# Altium schematic sheet BMS-BQ76930.SchDoc
size A2; SheetNumber: 1; SheetTotal: 3
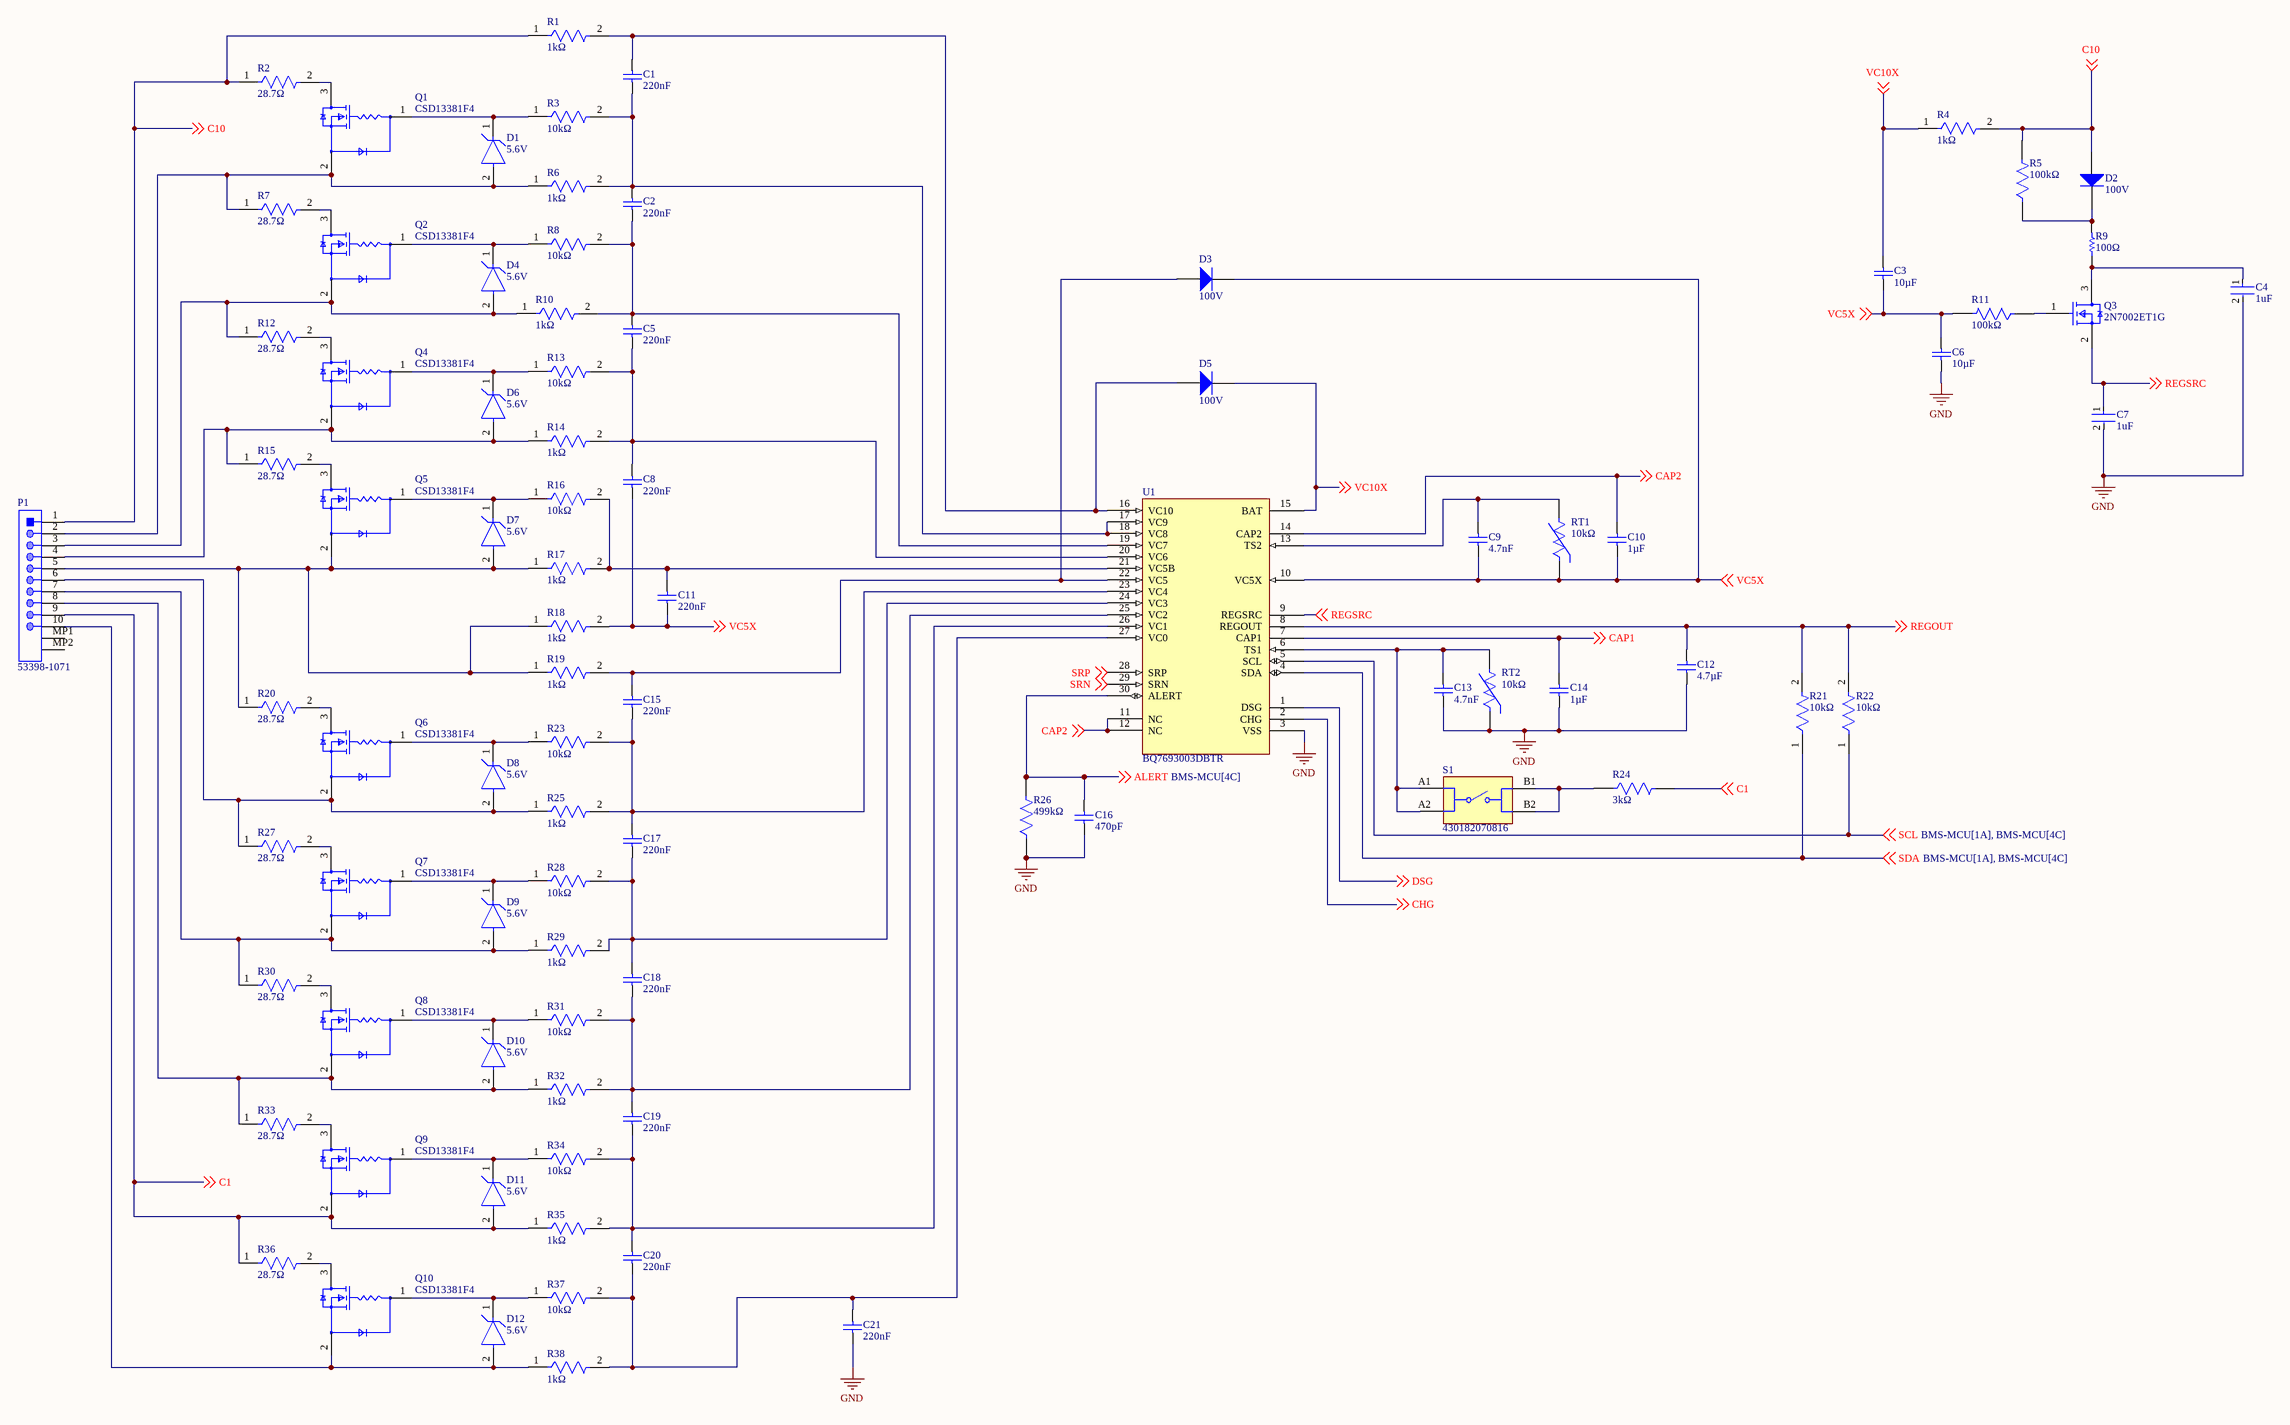
[diagram p0: BMS-BQ76930.SchDoc]

## Parts
C1  Capacitance: 220nF  [WCAP-CSGP_0603_L1.6W0.8H0.8_Reflow]  (hidden comment: 885012206048)
C2  Capacitance: 220nF  [WCAP-CSGP_0603_L1.6W0.8H0.8_Reflow]  (hidden comment: 885012206048)
C3  Capacitance: 10µF  [CAPC3225X270X30ML30]  (hidden comment: GRM32ER7YA106KA12L)
C4  Capacitance: 1uF  [FP-GCJ21B-0_3-IPC_B]  (hidden comment: GCJ21BR71H105KA01L)
C5  Capacitance: 220nF  [WCAP-CSGP_0603_L1.6W0.8H0.8_Reflow]  (hidden comment: 885012206048)
C6  Capacitance: 10µF  [CAPC3225X270X30ML30]  (hidden comment: GRM32ER7YA106KA12L)
C7  Capacitance: 1uF  [FP-GCJ21B-0_3-IPC_B]  (hidden comment: GCJ21BR71H105KA01L)
C8  Capacitance: 220nF  [WCAP-CSGP_0603_L1.6W0.8H0.8_Reflow]  (hidden comment: 885012206048)
C9  Capacitance: 4.7nF  [WCAP-CSGP_0603_L1.6W0.8H0.8_Reflow]  (hidden comment: 885012206087)
C10  Capacitance: 1µF  [WCAP-CSGP_0603_L1.6W0.8H0.8_Reflow]  (hidden comment: 885012206052)
C11  Capacitance: 220nF  [WCAP-CSGP_0603_L1.6W0.8H0.8_Reflow]  (hidden comment: 885012206048)
C12  Capacitance: 4.7µF  [WCAP-CSGP_0805_L2W1.25H1.25]  (hidden comment: 885012207025)
C13  Capacitance: 4.7nF  [WCAP-CSGP_0603_L1.6W0.8H0.8_Reflow]  (hidden comment: 885012206087)
C14  Capacitance: 1µF  [WCAP-CSGP_0603_L1.6W0.8H0.8_Reflow]  (hidden comment: 885012206052)
C15  Capacitance: 220nF  [WCAP-CSGP_0603_L1.6W0.8H0.8_Reflow]  (hidden comment: 885012206048)
C16  Capacitance: 470pF  [WCAP-CSGP_0603_L1.6W0.8H0.8_Reflow]  (hidden comment: 885012206081)
C17  Capacitance: 220nF  [WCAP-CSGP_0603_L1.6W0.8H0.8_Reflow]  (hidden comment: 885012206048)
C18  Capacitance: 220nF  [WCAP-CSGP_0603_L1.6W0.8H0.8_Reflow]  (hidden comment: 885012206048)
C19  Capacitance: 220nF  [WCAP-CSGP_0603_L1.6W0.8H0.8_Reflow]  (hidden comment: 885012206048)
C20  Capacitance: 220nF  [WCAP-CSGP_0603_L1.6W0.8H0.8_Reflow]  (hidden comment: 885012206048)
C21  Capacitance: 220nF  [WCAP-CSGP_0603_L1.6W0.8H0.8_Reflow]  (hidden comment: 885012206048)
D1  Voltage Rating (DC): 5.6V  [FP-477-02-MFG]  (hidden comment: MM3Z5V6ST1G)
D2  Peak Reverse Voltage: 100V  [DIOD-SOD123-2_V]  (hidden comment: 1N4148W-7-F)
D3  Peak Reverse Voltage: 100V  [DIOD-SOD123-2_V]  (hidden comment: 1N4148W-7-F)
D4  Voltage Rating (DC): 5.6V  [FP-477-02-MFG]  (hidden comment: MM3Z5V6ST1G)
D5  Peak Reverse Voltage: 100V  [DIOD-SOD123-2_V]  (hidden comment: 1N4148W-7-F)
D6  Voltage Rating (DC): 5.6V  [FP-477-02-MFG]  (hidden comment: MM3Z5V6ST1G)
D7  Voltage Rating (DC): 5.6V  [FP-477-02-MFG]  (hidden comment: MM3Z5V6ST1G)
D8  Voltage Rating (DC): 5.6V  [FP-477-02-MFG]  (hidden comment: MM3Z5V6ST1G)
D9  Voltage Rating (DC): 5.6V  [FP-477-02-MFG]  (hidden comment: MM3Z5V6ST1G)
D10  Voltage Rating (DC): 5.6V  [FP-477-02-MFG]  (hidden comment: MM3Z5V6ST1G)
D11  Voltage Rating (DC): 5.6V  [FP-477-02-MFG]  (hidden comment: MM3Z5V6ST1G)
D12  Voltage Rating (DC): 5.6V  [FP-477-02-MFG]  (hidden comment: MM3Z5V6ST1G)
P1  53398-1071  [MOLX-53398-1071_V]
Q1  CSD13381F4  [FP-CSD13381F4-MFG]
Q2  CSD13381F4  [FP-CSD13381F4-MFG]
Q3  2N7002ET1G  [FP-318-08-MFG]
Q4  CSD13381F4  [FP-CSD13381F4-MFG]
Q5  CSD13381F4  [FP-CSD13381F4-MFG]
Q6  CSD13381F4  [FP-CSD13381F4-MFG]
Q7  CSD13381F4  [FP-CSD13381F4-MFG]
Q8  CSD13381F4  [FP-CSD13381F4-MFG]
Q9  CSD13381F4  [FP-CSD13381F4-MFG]
Q10  CSD13381F4  [FP-CSD13381F4-MFG]
R1  Resistance: 1kΩ  [FP-CRCW0603-e3-MFG]  (hidden comment: CRCW06031K00JNEA)
R2  value 28.7Ω  (hidden comment: CRCW201028R7FKEF)
R3  Resistance: 10kΩ  [FP-CRCW0603-e3-MFG]  (hidden comment: CRCW060310K0JNEA)
R4  Resistance: 1kΩ  [FP-CRCW0603-e3-MFG]  (hidden comment: CRCW06031K00JNEA)
R5  Resistance: 100kΩ  [FP-CRCW0805-e3-MFG]  (hidden comment: CRCW0805100KFKEA)
R6  Resistance: 1kΩ  [FP-CRCW0603-e3-MFG]  (hidden comment: CRCW06031K00JNEA)
R7  value 28.7Ω  (hidden comment: CRCW201028R7FKEF)
R8  Resistance: 10kΩ  [FP-CRCW0603-e3-MFG]  (hidden comment: CRCW060310K0JNEA)
R9  Resistance: 100Ω  [RESC2013X50X30ML20T20]  (hidden comment: CRCW0805100RFKEA)
R10  Resistance: 1kΩ  [FP-CRCW0603-e3-MFG]  (hidden comment: CRCW06031K00JNEA)
R11  Resistance: 100kΩ  [FP-CRCW0805-e3-MFG]  (hidden comment: CRCW0805100KFKEA)
R12  value 28.7Ω  (hidden comment: CRCW201028R7FKEF)
R13  Resistance: 10kΩ  [FP-CRCW0603-e3-MFG]  (hidden comment: CRCW060310K0JNEA)
R14  Resistance: 1kΩ  [FP-CRCW0603-e3-MFG]  (hidden comment: CRCW06031K00JNEA)
R15  value 28.7Ω  (hidden comment: CRCW201028R7FKEF)
R16  Resistance: 10kΩ  [FP-CRCW0603-e3-MFG]  (hidden comment: CRCW060310K0JNEA)
R17  Resistance: 1kΩ  [FP-CRCW0603-e3-MFG]  (hidden comment: CRCW06031K00JNEA)
R18  Resistance: 1kΩ  [FP-CRCW0603-e3-MFG]  (hidden comment: CRCW06031K00JNEA)
R19  Resistance: 1kΩ  [FP-CRCW0603-e3-MFG]  (hidden comment: CRCW06031K00JNEA)
R20  value 28.7Ω  (hidden comment: CRCW201028R7FKEF)
R21  Resistance: 10kΩ  [FP-CRCW0603-e3-MFG]  (hidden comment: CRCW060310K0JNEA)
R22  Resistance: 10kΩ  [FP-CRCW0603-e3-MFG]  (hidden comment: CRCW060310K0JNEA)
R23  Resistance: 10kΩ  [FP-CRCW0603-e3-MFG]  (hidden comment: CRCW060310K0JNEA)
R24  Resistance: 3kΩ  [FP-CRCW0603-e3-MFG]  (hidden comment: CRCW06033K00JNEA)
R25  Resistance: 1kΩ  [FP-CRCW0603-e3-MFG]  (hidden comment: CRCW06031K00JNEA)
R26  Resistance: 499kΩ  [FP-CRCW0603-e3-MFG]  (hidden comment: CRCW0603499KFKEA)
R27  value 28.7Ω  (hidden comment: CRCW201028R7FKEF)
R28  Resistance: 10kΩ  [FP-CRCW0603-e3-MFG]  (hidden comment: CRCW060310K0JNEA)
R29  Resistance: 1kΩ  [FP-CRCW0603-e3-MFG]  (hidden comment: CRCW06031K00JNEA)
R30  value 28.7Ω  (hidden comment: CRCW201028R7FKEF)
R31  Resistance: 10kΩ  [FP-CRCW0603-e3-MFG]  (hidden comment: CRCW060310K0JNEA)
R32  Resistance: 1kΩ  [FP-CRCW0603-e3-MFG]  (hidden comment: CRCW06031K00JNEA)
R33  value 28.7Ω  (hidden comment: CRCW201028R7FKEF)
R34  Resistance: 10kΩ  [FP-CRCW0603-e3-MFG]  (hidden comment: CRCW060310K0JNEA)
R35  Resistance: 1kΩ  [FP-CRCW0603-e3-MFG]  (hidden comment: CRCW06031K00JNEA)
R36  value 28.7Ω  (hidden comment: CRCW201028R7FKEF)
R37  Resistance: 10kΩ  [FP-CRCW0603-e3-MFG]  (hidden comment: CRCW060310K0JNEA)
R38  Resistance: 1kΩ  [FP-CRCW0603-e3-MFG]  (hidden comment: CRCW06031K00JNEA)
RT1  Resistance: 10kΩ  [FP-103AT-2-MFG]  (hidden comment: 103AT-2)
RT2  Resistance: 10kΩ  [FP-103AT-2-MFG]  (hidden comment: 103AT-2)
S1  430182070816  [430182070816]
U1  BQ7693003DBTR  [FP-DBT0030A-IPC_C]

## Nets
GND: C4.2 C6.1 C7.2 C12.1 C13.1 C14.1 C16.1 C21.1 R26.1 RT2.1 U1.3(VSS)
ALERT: C16.2 R26.2 U1.30(ALERT) ; off-sheet ALERT
C1: D11.2(A) P1.9 Q9.2(S) R24.2 R35.1 R36.1 ; off-sheet C1
C10: D2.1(A) P1.1 R1.1 R2.1 R4.2 R5.2 ; off-sheet C10
CAP1: C14.2 U1.7(CAP1) ; off-sheet CAP1
CAP2: C10.2 U1.11(NC) U1.12(NC) U1.14(CAP2) ; off-sheet CAP2
CHG: U1.2(CHG) ; off-sheet CHG
DSG: U1.1(DSG) ; off-sheet DSG
REGOUT: C12.2 R21.2 R22.2 U1.8(REGOUT) ; off-sheet REGOUT
REGSRC: C7.1 Q3.2(Source) U1.9(REGSRC) ; off-sheet REGSRC
SCL: R22.1 U1.5(SCL) ; off-sheet SCL
SDA: R21.1 U1.4(SDA) ; off-sheet SDA
SRN: U1.29(SRN) ; off-sheet SRN
SRP: U1.28(SRP) ; off-sheet SRP
VC5X: C3.1 C6.2 C8.1 C9.1 C10.1 C11.1 D3.2(K) R11.2 R18.2 RT1.1 U1.10(VC5X) ; off-sheet VC5X
VC10X: C3.2 D5.2(K) R4.1 U1.15(BAT) ; off-sheet VC10X
NetC1_1: C1.1 C2.2 R3.2 R6.2 U1.17(VC9) U1.18(VC8)
NetC1_2: C1.2 D5.1(A) R1.2 U1.16(VC10)
NetC2_1: C2.1 C5.2 R8.2 R10.2 U1.19(VC7)
NetC4_1: C4.1 Q3.3(Drain) R9.1
NetC5_1: C5.1 C8.2 R13.2 R14.2 U1.20(VC6)
NetC9_2: C9.2 RT1.2 U1.13(TS2)
NetC11_2: C11.2 R16.2 R17.2 U1.21(VC5B)
NetC13_2: C13.2 RT2.2 S1.A1 S1.A2 U1.6(TS1)
NetC15_1: C15.1 C17.2 R23.2 R25.2 U1.23(VC4)
NetC15_2: C15.2 D3.1(A) R19.2 U1.22(VC5)
NetC17_1: C17.1 C18.2 R28.2 R29.2 U1.24(VC3)
NetC18_1: C18.1 C19.2 R31.2 R32.2 U1.25(VC2)
NetC19_1: C19.1 C20.2 R34.2 R35.2 U1.26(VC1)
NetC20_1: C20.1 C21.2 R37.2 R38.2 U1.27(VC0)
NetD1_1: D1.1(C) Q1.1(G) R3.1
NetD1_2: D1.2(A) P1.2 Q1.2(S) R6.1 R7.1
NetD2_2: D2.2(K) R5.1 R9.2
NetD4_1: D4.1(C) Q2.1(G) R8.1
NetD4_2: D4.2(A) P1.3 Q2.2(S) R10.1 R12.1
NetD6_1: D6.1(C) Q4.1(G) R13.1
NetD6_2: D6.2(A) P1.4 Q4.2(S) R14.1 R15.1
NetD7_1: D7.1(C) Q5.1(G) R16.1
NetD7_2: D7.2(A) P1.5 Q5.2(S) R17.1 R18.1 R19.1 R20.1
NetD8_1: D8.1(C) Q6.1(G) R23.1
NetD8_2: D8.2(A) P1.6 Q6.2(S) R25.1 R27.1
NetD9_1: D9.1(C) Q7.1(G) R28.1
NetD9_2: D9.2(A) P1.7 Q7.2(S) R29.1 R30.1
NetD10_1: D10.1(C) Q8.1(G) R31.1
NetD10_2: D10.2(A) P1.8 Q8.2(S) R32.1 R33.1
NetD11_1: D11.1(C) Q9.1(G) R34.1
NetD12_1: D12.1(C) Q10.1(G) R37.1
NetD12_2: D12.2(A) P1.10 Q10.2(S) R38.1
NetQ1_3: Q1.3(D) R2.2
NetQ2_3: Q2.3(D) R7.2
NetQ3_1: Q3.1(Gate) R11.1
NetQ4_3: Q4.3(D) R12.2
NetQ5_3: Q5.3(D) R15.2
NetQ6_3: Q6.3(D) R20.2
NetQ7_3: Q7.3(D) R27.2
NetQ8_3: Q8.3(D) R30.2
NetQ9_3: Q9.3(D) R33.2
NetQ10_3: Q10.3(D) R36.2
NetR24_1: R24.1 S1.B1 S1.B2

Not connected (* = marked no-connect by the designer): P1 MP1 MP2

## Library data of the parts
C1 C2 C5 C8 C11 C15 C17-C21 = CMP-03913-53914757-1: 885012206048 Ceramic Capacitor 220nF, 16VDC, 0603, ±10 %; Voltage Rating (DC): 16V; Insulation Resistance: 2.3GΩ; Dielectric: X7R; Tolerance: 10%; Width: 800µm; Packaging: Tape & Reel (TR); RoHS: Compliant; Length: 1.6mm; REACH SVHC: Unknown; Voltage Rating: 16V; Min Operating Temperature: -55°C; Thickness: 863.6µm; Case Code (Imperial): 0603; Case Code (Metric): 1608; Height: 800µm; NexarPartId: 53914757; Max Operating Temperature: 125°C; Mount: Surface Mount; Case/Package: 0603; Supplier 1: Mouser; Supplier Part Number 1: 710-885012206048
C3 C6 = CMP-1038-02234-2: Chip Capacitor, 10 uF, +/- 10%, 35 V, -55 to 125 degC, 1210 (3225 Metric), RoHS, Tape and Reel; Manufacturer: Murata; Rated voltage: 35VDC; Ceramic type: X7R; Construction form: 1210; Package Description: 2-Pin Surface Mount Device, Body 3.2 x 2.5 mm; Datasheet Version: 11/2014; Capacitance tolerance: ±10%; Datasheet URL: https://datasheet.ciiva.com/3777/grm32er7ya106ka1223-3777248.pdf; Package Reference: 1210; Manufacturer URL: http://www.murata.com/; Mounting Technology: SurfaceMount; Supplier 1: Mouser; Supplier Part Number 1: 81-GRM32ER7YA106KA2L
C4 C7 = CMP-06035-043290-1: Multilayer Ceramic Capacitors MLCC - SMD/SMT 0805 1uF 10%, 50VDC,  X7R 15%; Voltage Rating (DC): 50V; Max Operating Temperature: 125°C; Ratings: AEC-Q200; Height: 1.25mm; Lead Free: Lead Free; Weight: 0.000335oz; Thickness: 0.057inch; Min Operating Temperature: -55°C; Termination: SMD/SMT; Features: Soft Termination; Mount: Surface Mount; Voltage Rating: 50V; Case Code (Imperial): 0805; Package Quantity: 3000; Tolerance: 10%; Width: 0.049inch; Case/Package: 0805; Case Code (Metric): 2012; Dielectric: X7R; Packaging: Tape and Reel; Length: 0.079inch; Supplier 1: Mouser; Supplier Part Number 1: 81-GCJ21BR71H105KA1L
C9 C13 = CMP-03913-53914796-1: 885012206087 Cap Cer 4700PF 50V X7R 0603; Insulation Resistance: 10GΩ; Tolerance: 10%; NexarPartId: 53914796; Case/Package: 0603; Height: 800µm; Mount: Surface Mount; RoHS: Compliant; Dielectric: X7R; Length: 1.6mm; Max Operating Temperature: 125°C; REACH SVHC: Unknown; Packaging: Tape & Reel (TR); Voltage Rating (DC): 50V; Width: 800µm; Voltage Rating: 50V; Thickness: 939.8µm; Min Operating Temperature: -55°C; Case Code (Metric): 1608; Case Code (Imperial): 0603; Supplier 1: Mouser; Supplier Part Number 1: 710-885012206087; Supplier 2: Digikey; Supplier Part Number 2: 732-8005-1-ND
C10 C14 = CMP-03913-53914761-1: 885012206052 Capacitor, 1uF Multilayer Ceramic MLCC 16 V , X7R Dielectric 0603 Surface Mount | Wurth Electronics 885012206052; Tolerance: 10%; Voltage Rating: 16V; Insulation Resistance: 100MΩ; Case/Package: 0603; Thickness: 939.8µm; Width: 800µm; Mount: Surface Mount; Case Code (Metric): 1608; NexarPartId: 53914761; Height: 800µm; Min Operating Temperature: -55°C; RoHS: Compliant; Length: 1.6mm; Material: Ceramic; Case Code (Imperial): 0603; Max Operating Temperature: 125°C; Packaging: Cut Tape (CT); Dielectric: X7R; REACH SVHC: Unknown; Voltage Rating (DC): 16V; Supplier 1: Digikey; Supplier Part Number 1: 732-7971-1-ND
C12 = CMP-03913-65419799-1: 885012207025 Multilayer Ceramic Capacitor, Wcap-Csgp Series, 4.7 F, 10%, X7R, 10 V, 0805 [2012 Metric] Rohs Compliant: Yes; Voltage Rating: 10V; Insulation Resistance: 20MΩ; Max Operating Temperature: 125°C; Case Code (Metric): 2012; Height: 1.25mm; Mount: Surface Mount; Thickness: 1.4478mm; Length: 2mm; NexarPartId: 65419799; Voltage Rating (DC): 10V; Case Code (Imperial): 0805; REACH SVHC: Unknown; Packaging: Tape & Reel (TR); Width: 1.25mm; Min Operating Temperature: -55°C; Tolerance: 10%; RoHS: Compliant; Case/Package: 0805; Dielectric: X7R; Supplier 1: Mouser; Supplier Part Number 1: 710-885012207025; Supplier 2: Digikey; Supplier Part Number 2: 732-7657-1-ND
C16 = CMP-03913-53914790-1: 885012206081 Cap Cer 470PF 50V X7R 0603; Insulation Resistance: 10GΩ; Tolerance: 10%; Min Operating Temperature: -55°C; Max Operating Temperature: 125°C; Length: 1.6mm; Packaging: Tape & Reel (TR); Case/Package: 0603; Height: 800µm; Thickness: 939.8µm; Voltage Rating (DC): 50V; Voltage Rating: 50V; Width: 800µm; Mount: Surface Mount; Case Code (Imperial): 0603; Dielectric: X7R; NexarPartId: 53914790; RoHS: Compliant; Case Code (Metric): 1608; Supplier 1: Mouser; Supplier Part Number 1: 710-885012206081; Supplier 2: Digikey; Supplier Part Number 2: 732-7999-1-ND
D1 D4 D6-D12 = CMP-1060-00706-2: DIODE ZENER 5.6V 300MW SOD323; Test Current: 5mA; Power Rating: 200mW; ESD Protection: Yes; Peak Reverse Current: 1uA; Voltage Tolerance: 2%; Forward Voltage: 900mV; Impedance: 40R; Element Configuration: Single; Material: Plastic; Zener Current: 10mA; Length: 1.8mm; Package Quantity: 1; Contact Plating: Tin; Number of Pins: 2; Case/Package: SOD-323-2; Max Power Dissipation: 200mW; Lead Free: Lead Free; Radiation Hardening: No; Width: 1.35mm; REACH SVHC: No SVHC; Zener Voltage: 5.6V; Height: 1mm; Max Reverse Leakage Current: 1uA; Packaging: Tape and Reel; Min Operating Temperature: -65°C; Power Dissipation: 200mW; Max Operating Temperature: 150°C; Working Voltage: 5.6V; Tolerance: 2%; Supplier 1: Mouser; Supplier Part Number 1: 863-MM3Z5V6ST1G; Supplier 2: Digikey; Supplier Part Number 2: MM3Z5V6ST1GOSCT-ND
D2 D3 D5 = CMP-2000-04932-2: Fast Switching Diode, 100 V, 0.15 A, -65 to 150 degC, 2-Pin?SOD123, RoHS, Tape and Reel; Recovery Time: 4ns; Brand: DiodesIncorporated; Unit Weight: 0.000353oz; Max Surge Current: 2A; Ir - Reverse Current: 1uA; Vf - Forward Voltage: 1.25V; Configuration: Single; If - Forward Current: 0.15A; Product Category: Diodes-GeneralPurpose,Power,Switching; Operating Temperature Range: -65Cto+150C; Packaging: Reel; Manufacturer URL: http://www.diodes.com/; Maximum Operating Temperature: +150C; Height: 1.25mm; Minimum Operating Temperature: -65C; Product: SwitchingDiodes; Package URL: http://www.diodes.com/datasheets/ds18004.pdf; Type: SwitchingDiode; Package Reference: SOD123-2; Width: 1.7mm; Datasheet URL: http://www.farnell.com/datasheets/1915529.pdf; Datasheet Version: Rev. 24-2, 10/2013; Series: 1N4148; Factory Pack Quantity: 3000; Length: 2.85mm; RoHS: True; Manufacturer: DiodesIncorporated; Mounting Style: SMD/SMT; Package / Case: SOD-123; Supplier 1: Mouser; Supplier Part Number 1: 621-1N4148W-F; Supplier 2: Digikey; Supplier Part Number 2: 1N4148W-FDICT-ND
P1 = CMP-2000-05635-1: Male Header, Pitch 1.25 mm, 1 x 10 Position, Height 4.7 mm, -40 to 85 degC, RoHS, Tape and Reel; Manufacturer: Molex; Mounting Angle: Vertical; Pitch: 1.25mm; Voltage Rating: 125V; Current Rating: 1A; Number of Rows: 1Row; Housing Material: Nylon; Mounting Technology: SurfaceMount; Mounting Style: SMD; Contact Material: PhosphorBronze; Product: Headers; Datasheet URL: http://www.molex.com/pdm_docs/sd/533981071_sd.pdf; Manufacturer URL: http://www.molex.com/; Datasheet Version: Rev. J, 09/2015; Factory Pack Quantity: 1000; Brand: Molex; Packaging: Reel; Product Category: Headers&WireHousings; Contact Gender: Pin(Male); Number of Positions: 10Position; RoHS: Details; Contact Plating: Tin; Package Description: Male Header, Pitch 1.25 mm, 1 x 10 Position, Height 4.7 mm; Series: 53398; Type: Shrouded; Package Reference: 53398-1071; Tradename: PicoBlade; Termination Style: SMD; Supplier 1: Mouser; Supplier Part Number 1: 538-53398-1071
Q1 Q2 Q4-Q10 = CMP-04962-000059-1: MOSFET N-CH 12V 2.1A 3PICOSTAR; Rise Time: 1.5ns; Gate to Source Voltage (Vgs): 8V; Max Power Dissipation: 500mW; Number of Elements: 1; Element Configuration: Single; Turn-Off Delay Time: 11ns; Turn-On Delay Time: 3.7ns; Drain to Source Resistance: 180mR; Input Capacitance: 200pF; Fall Time: 3.8ns; Number of Pins: 3; Drain to Source Breakdown Voltage: 12V; Package Quantity: 3000; Power Dissipation: 500mW; RoHS Compliant: Yes; Case/Package: QFN; Max Operating Temperature: 150°C; Mount: Surface Mount; Continuous Drain Current (ID): 2.1A; Drain to Source Voltage (Vdss): 12V; Number of Channels: 1; Rds On Max: 180mR; Packaging: Tape and Reel; Lead Free: Lead Free; Min Operating Temperature: -55°C; Supplier 1: Mouser; Supplier Part Number 1: 595-CSD13381F4
Q3 = CMP-1058-00769-2: MOSFET N-CH 60V 260MA SOT-23; On-State Resistance: 2.5R; Turn-Off Delay Time: 4.8ns; Nominal Vgs: 1V; Element Configuration: Single; Rise Time: 1.2ns; Input Capacitance: 26.7pF; Number of Elements: 1; Turn-On Delay Time: 1.7ns; Gate to Source Voltage (Vgs): 20V; Max Power Dissipation: 300mW; Drain to Source Breakdown Voltage: 60V; Max Operating Temperature: 150°C; REACH SVHC: No SVHC; Case/Package: SOT-23-3; Lead Free: Lead Free; Length: 2.9mm; Height: 0.94mm; Package Quantity: 3000; Min Operating Temperature: -55°C; Radiation Hardening: No; Packaging: Tape and Reel; Fall Time: 1.2ns; Drain to Source Resistance: 2.5R; Halogen Free: Halogen Free; Threshold Voltage: 1V; Number of Pins: 3; Continuous Drain Current (ID): 260mA; Rds On Max: 2.5R; Power Dissipation: 300mW; Width: 1.3mm; Supplier 1: Mouser; Supplier Part Number 1: 863-2N7002ET1G; Supplier 2: Digikey; Supplier Part Number 2: 2N7002ET1GOSCT-ND
R1 R4 R6 R10 R14 R17-R19 R25 R29 R32 R35 R38 = CMP-02407-007100-1: RES Thick Film, 1kΩ, 5%, 0.1W, 200ppm/°C, 0603; Power Rating: 100mW; Voltage Rating: 75V; Height: 0.02inch; Number of Terminations: 2; Radiation Hardening: No; Max Operating Temperature: 155°C; Packaging: Tape and Reel; Package Quantity: 1; Military Standard: Not; Case/Package: 0603; Weight: 7.1E-05oz; Tolerance: 5%; Temperature Coefficient: 200ppm/°C; Termination: SMD/SMT; Case Code (Metric): 1608; Length: 1.55mm; Min Operating Temperature: -55°C; Depth: 0.85mm; Composition: Thick Film; Width: 0.033inch; Number of Pins: 2; Contact Plating: Tin; Max Power Dissipation: 100mW; Voltage Rating (DC): 75V; Case Code (Imperial): 0603; Lead Free: Lead Free; Features: Automotive AEC-Q200; Supplier 1: Mouser; Supplier Part Number 1: 71-CRCW0603J-1.0K-E3
R2 R7 R12 R15 R20 R27 R30 R33 R36 = CRCW201028R7FKEF: Fixed Resistor, Metal Glaze/thick Film, 0.75W, 28.7ohm, 400V, 1% +/-Tol, 100ppm/Cel, Surface Mount, 2010; Manufacturer: Vishay Dale; Manufacturer Series: CRCWE3; Power: 750mW; Rated Temperature: 70°C; Temperature Coefficient: 100ppm/°C; Additional Feature: RATED AC VOLTAGE (V): 400; Package Height: 0.6mm; Package Length: 5mm; Package Width: 2.5mm; Reference Standard: AEC-Q200; Supplier: Mouser; Supplier Part Number: 71-CRCW201028R7FKEF; Manufacturer Part Number: CRCW201028R7FKEF; RoHS: Yes; Category: Chip SMD Resistors; Stock: 2319; Pricing: 1=0.22, 10=0.093, 50=0.093, 100=0.059, 1000=0.051, 10000=0.033 (USD); Mounting Technology: Surface Mount; Pins: 2; Package Shape: Rectangular; Case/Package: 2010; Terminal Finish: Nickel; Min Operating Temperature: -55°C; Max Operating Temperature: 155°C; Tolerance: 1%; JESD-609 Code: e3; Resistor Type: FIXED RESISTOR; Construction: Chip; Packaging: Tape and Reel; Series: D/CRCW E3; Technology: METAL GLAZE/THICK FILM; Termination: Wraparound; Working Voltage: 400V; Reach SVHC Compliant: Yes; RoHS Compliant: Yes; ComponentLink1URL: https://datasheet.ciiva.com:443/pdfs/VipMasterIC/IC/VISH/VISH-S-A0007266705/VISH-S-A0007266705-1.pdf?src-supplier=IHS+Markit; ComponentLink1Description: https://datasheet.ciiva.com:443/pdfs/VipMasterIC/IC/VISH/VISH-S-A0007266705/VISH-S-A0007266705-1.pdf?src-supplier=IHS+Markit; ComponentLink2URL: https://datasheet.ciiva.com/2477/dcrcwe3-2477004.pdf?src-supplier=Digikey; ComponentLink2Description: https://datasheet.ciiva.com/2477/dcrcwe3-2477004.pdf?src-supplier=Digikey; ComponentLink3URL: https://datasheet.ciiva.com/2477/dcrcwe3-2477005.pdf?src-supplier=Digikey; ComponentLink3Description: https://datasheet.ciiva.com/2477/dcrcwe3-2477005.pdf?src-supplier=Digikey; ComponentLink4URL: https://datasheet.ciiva.com/2477/dcrcwe3-2477006.pdf?src-supplier=Digikey; ComponentLink4Description: https://datasheet.ciiva.com/2477/dcrcwe3-2477006.pdf?src-supplier=Digikey; Supplier 1: Mouser; Supplier Part Number 1: 71-CRCW201028R7FKEF
R3 R8 R13 R16 R21-R23 R28 R31 R34 R37 = CMP-2000-03838-2: RES Thick Film, 10kΩ, 5%, 0.1W, 200ppm/°C, 0603; Max Power Dissipation: 100mW; Voltage Rating: 75V; Termination: SMD/SMT; Depth: 0.85mm; Weight: 7.1E-05oz; Military Standard: Not; Case Code (Imperial): 0603; Lead Free: Lead Free; Features: Automotive AEC-Q200; Tolerance: 5%; Case Code (Metric): 1608; Package Quantity: 1; Radiation Hardening: No; Number of Terminations: 2; Max Operating Temperature: 155°C; Min Operating Temperature: -55°C; Composition: Thick Film; Number of Pins: 2; Height: 0.02inch; Contact Plating: Tin; Temperature Coefficient: 200ppm/°C; Width: 0.033inch; Packaging: Tape and Reel; Length: 1.55mm; Mount: Surface Mount; Voltage Rating (DC): 75V; Case/Package: 0603; Power Rating: 100mW; Supplier 1: Mouser; Supplier Part Number 1: 71-CRCW0603J-10K-E3
R5 R11 = CMP-2001-04899-2: RES Thick Film, 100kΩ, 1%, 0.125W, 100ppm/°C, 0805; Power Rating: 125mW; Voltage Rating: 150V; Case/Package: 0805; Max Operating Temperature: 155°C; Case Code (Imperial): 0805; Lead Free: Lead Free; Weight: 0.000194oz; Number of Pins: 2; Package Quantity: 5000; Height: 0.45mm; Composition: Thick Film; Military Standard: Not; Tolerance: 1%; Case Code (Metric): 2012; Termination: SMD/SMT; Mount: Surface Mount; Radiation Hardening: No; Width: 1.25mm; Length: 2mm; Depth: 1.25mm; Packaging: Tape and Reel; Min Operating Temperature: -55°C; Contact Plating: Tin; Temperature Coefficient: 100ppm/°C; Voltage Rating (DC): 150V; Supplier 1: Mouser; Supplier Part Number 1: 71-CRCW0805-100K-E3
R9 = CMP-2001-04901-1: Manufacturer: Vishay Dale; Part Number: CRCW0805100RFKEA; Supplier 1: Digikey; Supplier Part Number 1: 541-100CCT-ND
R24 = CMP-2000-03294-2: RES Thick Film, 3kΩ, 5%, 0.1W, 200ppm/°C, 0603; Voltage Rating: 75V; Power Rating: 100mW; Mount: Surface Mount; Number of Pins: 2; Weight: 7.1E-05oz; Voltage Rating (DC): 75V; Case Code (Imperial): 0603; Length: 1.55mm; Max Operating Temperature: 155°C; Contact Plating: Tin; Radiation Hardening: No; Temperature Coefficient: 200ppm/°C; Case Code (Metric): 1608; Min Operating Temperature: -55°C; Depth: 0.85mm; Termination: SMD/SMT; Height: 0.02inch; Features: Automotive AEC-Q200; Tolerance: 5%; Number of Terminations: 2; Military Standard: Not; Width: 0.85mm; Case/Package: 0603; Composition: Thick Film; Lead Free: Lead Free; Max Power Dissipation: 100mW; Packaging: Tape and Reel; Working Voltage: 75V; Package Quantity: 1; Supplier 1: Mouser; Supplier Part Number 1: 71-CRCW0603J-3.0K-E3
R26 = CMP-2000-03389-2: Fixed Resistor, Metal Glaze/thick Film, 0.1W, 499000ohm, 75V, 1% +/-Tol, 100ppm/Cel, Surface Mount, 0603; Manufacturer: Vishay; Temperature Coefficient: 100ppm/°C; Power Rating: 100mW; Value: 499kR; Rated Temperature: 70°C; Package Height: 0.45mm; Package Length: 1.55mm; Package Width: 0.85mm; Reference Standard: AEC-Q200; Min Operating Temperature: -55°C; Radiation Hardening: No; Weight: 7.1E-05oz; Case/Package: 0603; Depth: 0.85mm; Package Quantity: 10; Working Voltage: 75V; Height: 0.45mm; Voltage Rating (DC): 75V; Case Code (Metric): 1608; Case Code (Imperial): 0603; Number of Pins: 2; Lead Free: Lead Free; Contact Plating: Tin; Max Power Dissipation: 100mW; Features: Automotive AEC-Q200; Max Operating Temperature: 155°C; Width: 0.85mm; Termination: SMD/SMT; Packaging: Tape and Reel; Tolerance: 1%; Number of Terminations: 2; Military Standard: Not; Length: 1.55mm; Composition: Thick Film; Mount: Surface Mount; Voltage Rating: 75V; Supplier 1: Digikey; Supplier Part Number 1: 541-499KHDKR-ND; Supplier 2: Digikey; Supplier Part Number 2: 541-499KHCT-ND; Supplier 3: Mouser; Supplier Part Number 3: 71-CRCW0603-499K-E3; Supplier: Mouser; Supplier Part Number: 71-CRCW0603-499K-E3; Manufacturer Part Number: CRCW0603499KFKEA; RoHS: Yes; Category: Chip SMD Resistors; Stock: 55441; Pricing: 1=0.1, 10=0.017, 50=0.017, 100=0.01, 1000=0.008, 10000=0.005 (USD); Mounting Technology: Surface Mount; Pins: 2; Terminal Finish: Nickel; Package Shape: Rectangular; JESD-609 Code: e3; Resistor Type: FIXED RESISTOR; Construction: Chip; Power: 100mW; Technology: METAL GLAZE/THICK FILM; Reach SVHC Compliant: Yes; RoHS Compliant: Yes; ComponentLink1URL: https://datasheet.ciiva.com:443/pdfs/VipMasterIC/IC/VISH/VISH-S-A0007266705/VISH-S-A0007266705-1.pdf?src-supplier=IHS+Markit; ComponentLink1Description: https://datasheet.ciiva.com:443/pdfs/VipMasterIC/IC/VISH/VISH-S-A0007266705/VISH-S-A0007266705-1.pdf?src-supplier=IHS+Markit; ComponentLink2URL: https://datasheet.ciiva.com/11811/0900766b80d98afc-11811204.pdf?src-supplier=Rs; ComponentLink2Description: https://datasheet.ciiva.com/11811/0900766b80d98afc-11811204.pdf?src-supplier=Rs; ComponentLink3URL: https://datasheet.ciiva.com/3257/dcrcwe3-3257647.pdf?src-supplier=Avnet; ComponentLink3Description: https://datasheet.ciiva.com/3257/dcrcwe3-3257647.pdf?src-supplier=Avnet; ComponentLink4URL: https://datasheet.ciiva.com/2465/dcrcwe3-2465609.pdf?src-supplier=Digikey; ComponentLink4Description: https://datasheet.ciiva.com/2465/dcrcwe3-2465609.pdf?src-supplier=Digikey; ComponentLink5URL: https://datasheet.ciiva.com/2465/dcrcwe3-2465610.pdf?src-supplier=Digikey; ComponentLink5Description: https://datasheet.ciiva.com/2465/dcrcwe3-2465610.pdf?src-supplier=Digikey; ComponentLink6URL: https://datasheet.ciiva.com/2465/dcrcwe3-2465611.pdf?src-supplier=Digikey; ComponentLink6Description: https://datasheet.ciiva.com/2465/dcrcwe3-2465611.pdf?src-supplier=Digikey; ComponentLink7URL: https://datasheet.ciiva.com/16784/70201119-16784775.pdf?src-supplier=Allied+Electronics; ComponentLink7Description: https://datasheet.ciiva.com/16784/70201119-16784775.pdf?src-supplier=Allied+Electronics; ComponentLink8URL: https://datasheet.ciiva.com/7168/1635184-7168517.pdf?src-supplier=Newark; ComponentLink8Description: https://datasheet.ciiva.com/7168/1635184-7168517.pdf?src-supplier=Newark; ComponentLink9URL: https://datasheet.ciiva.com/16200/dcrcwe3-16200202.pdf?src-supplier=Future+Electronics; ComponentLink9Description: https://datasheet.ciiva.com/16200/dcrcwe3-16200202.pdf?src-supplier=Future+Electronics; ComponentLink10URL: https://datasheet.ciiva.com/5551/dcrcwe3-109170-5551960.pdf?src-supplier=Mouser; ComponentLink10Description: https://datasheet.ciiva.com/5551/dcrcwe3-109170-5551960.pdf?src-supplier=Mouser
RT1 RT2 = CMP-2000-05824-2: Thermistor NTC 10KOhm 1% 2-Pin; Lead Pitch: 2.54mm; Height: 2.4mm; Max Operating Temperature: 110°C; Width: 3.7mm; RoHS Compliant: Yes; Min Operating Temperature: -50°C; Termination: Radial; Packaging: Bulk; Number of Pins: 2; Series: AT; Tolerance: 1%; Length: 17mm; Supplier 1: Mouser; Supplier Part Number 1: 954-103AT-2
S1 = CMP-1452-00015-3: Switch Tactile Spst-no 0.05A 12V; Life (Cycles): 1Mcycles; Switch Travel: 250µm; Throw Configuration: SPST; Switch Function: Off-Mom; Actuator Material: Liquid Crystal Polymer, Polymer; Contact Current Rating: 50mA; Illumination Type: Illuminated, Non-Illuminated; Insulation Resistance: 100MΩ; Actuator Length: 3.6mm; Color: Black; Mount: Surface Mount; Contact Material: Stainless Steel, Steel; REACH SVHC: No SVHC; Width: 6.2mm; Voltage Rating (DC): 12V; RoHS: Compliant; Length: 6.2mm; Height: 7mm; Current Rating: 50mA; Lead Free: Lead Free; Termination: Gull Wing; Min Operating Temperature: -40°C; Voltage Rating: 12V; Max Operating Temperature: 85°C; Diameter: 3mm; Contact Plating: Silver; Packaging: Tape and Reel; Mechanical Life: 1Mcycles; Contact Resistance: 100mΩ; Supplier 1: Mouser; Supplier Part Number 1: 710-430182070816
U1 = CMP-04911-000006-1: IC BATT MGMT LI-ION AFE 30TSSOP; Manufacturer: Texas Instruments; Max Supply Voltage: 25V; Nominal Supply Current: 40-130uA; Number Of Outputs: 2; Number Of Cells: 10; Standoff Height: 0.05mm; Min Supply Voltage: 6V; Octopart: https://octopart.com/bq7693003dbtr-texas+instruments-34472212; Digikey Description: IC BATT MGMT LI-ION AFE 30TSSOP; Ipc Land Pattern Name: SOP50P635X120-30; Mouser Description: 6 to 10-Series Cell Li-Ion and Li-Phosphate Battery Monitor (bq76940 Family) 30-TSSOP -40 to 85; Package: DBT0030A; Manufacturer Part Number: BQ7693003DBTR; Device Class L1: Integrated Circuits (ICs); Temperature Range High: +85°C; RoHS: TRUE; Category: IC; Temperature: -40°C to +85°C; Automotive: No; Device Class L3: Battery Management; ComponentLink2Description: Datasheet; Device Class L2: Power Management ICs; ComponentLink2URL: http://www.ti.com/lit/ds/symlink/bq76930.pdf; Height: 1.2mm; Temperature Range Low: -40°C; Lead Free: Yes; Supplier 1: Mouser; Supplier Part Number 1: 595-BQ7693003DBTR; Supplier 2: Digikey; Supplier Part Number 2: 296-39961-1-ND